# Altium schematic sheet CAN-FD.SchDoc
size 420 x 297 mm; SheetNumber: 28; SheetTotal: 42; DocumentTypeShort: Э3; DocumentInvertoryNumber: ㅤ
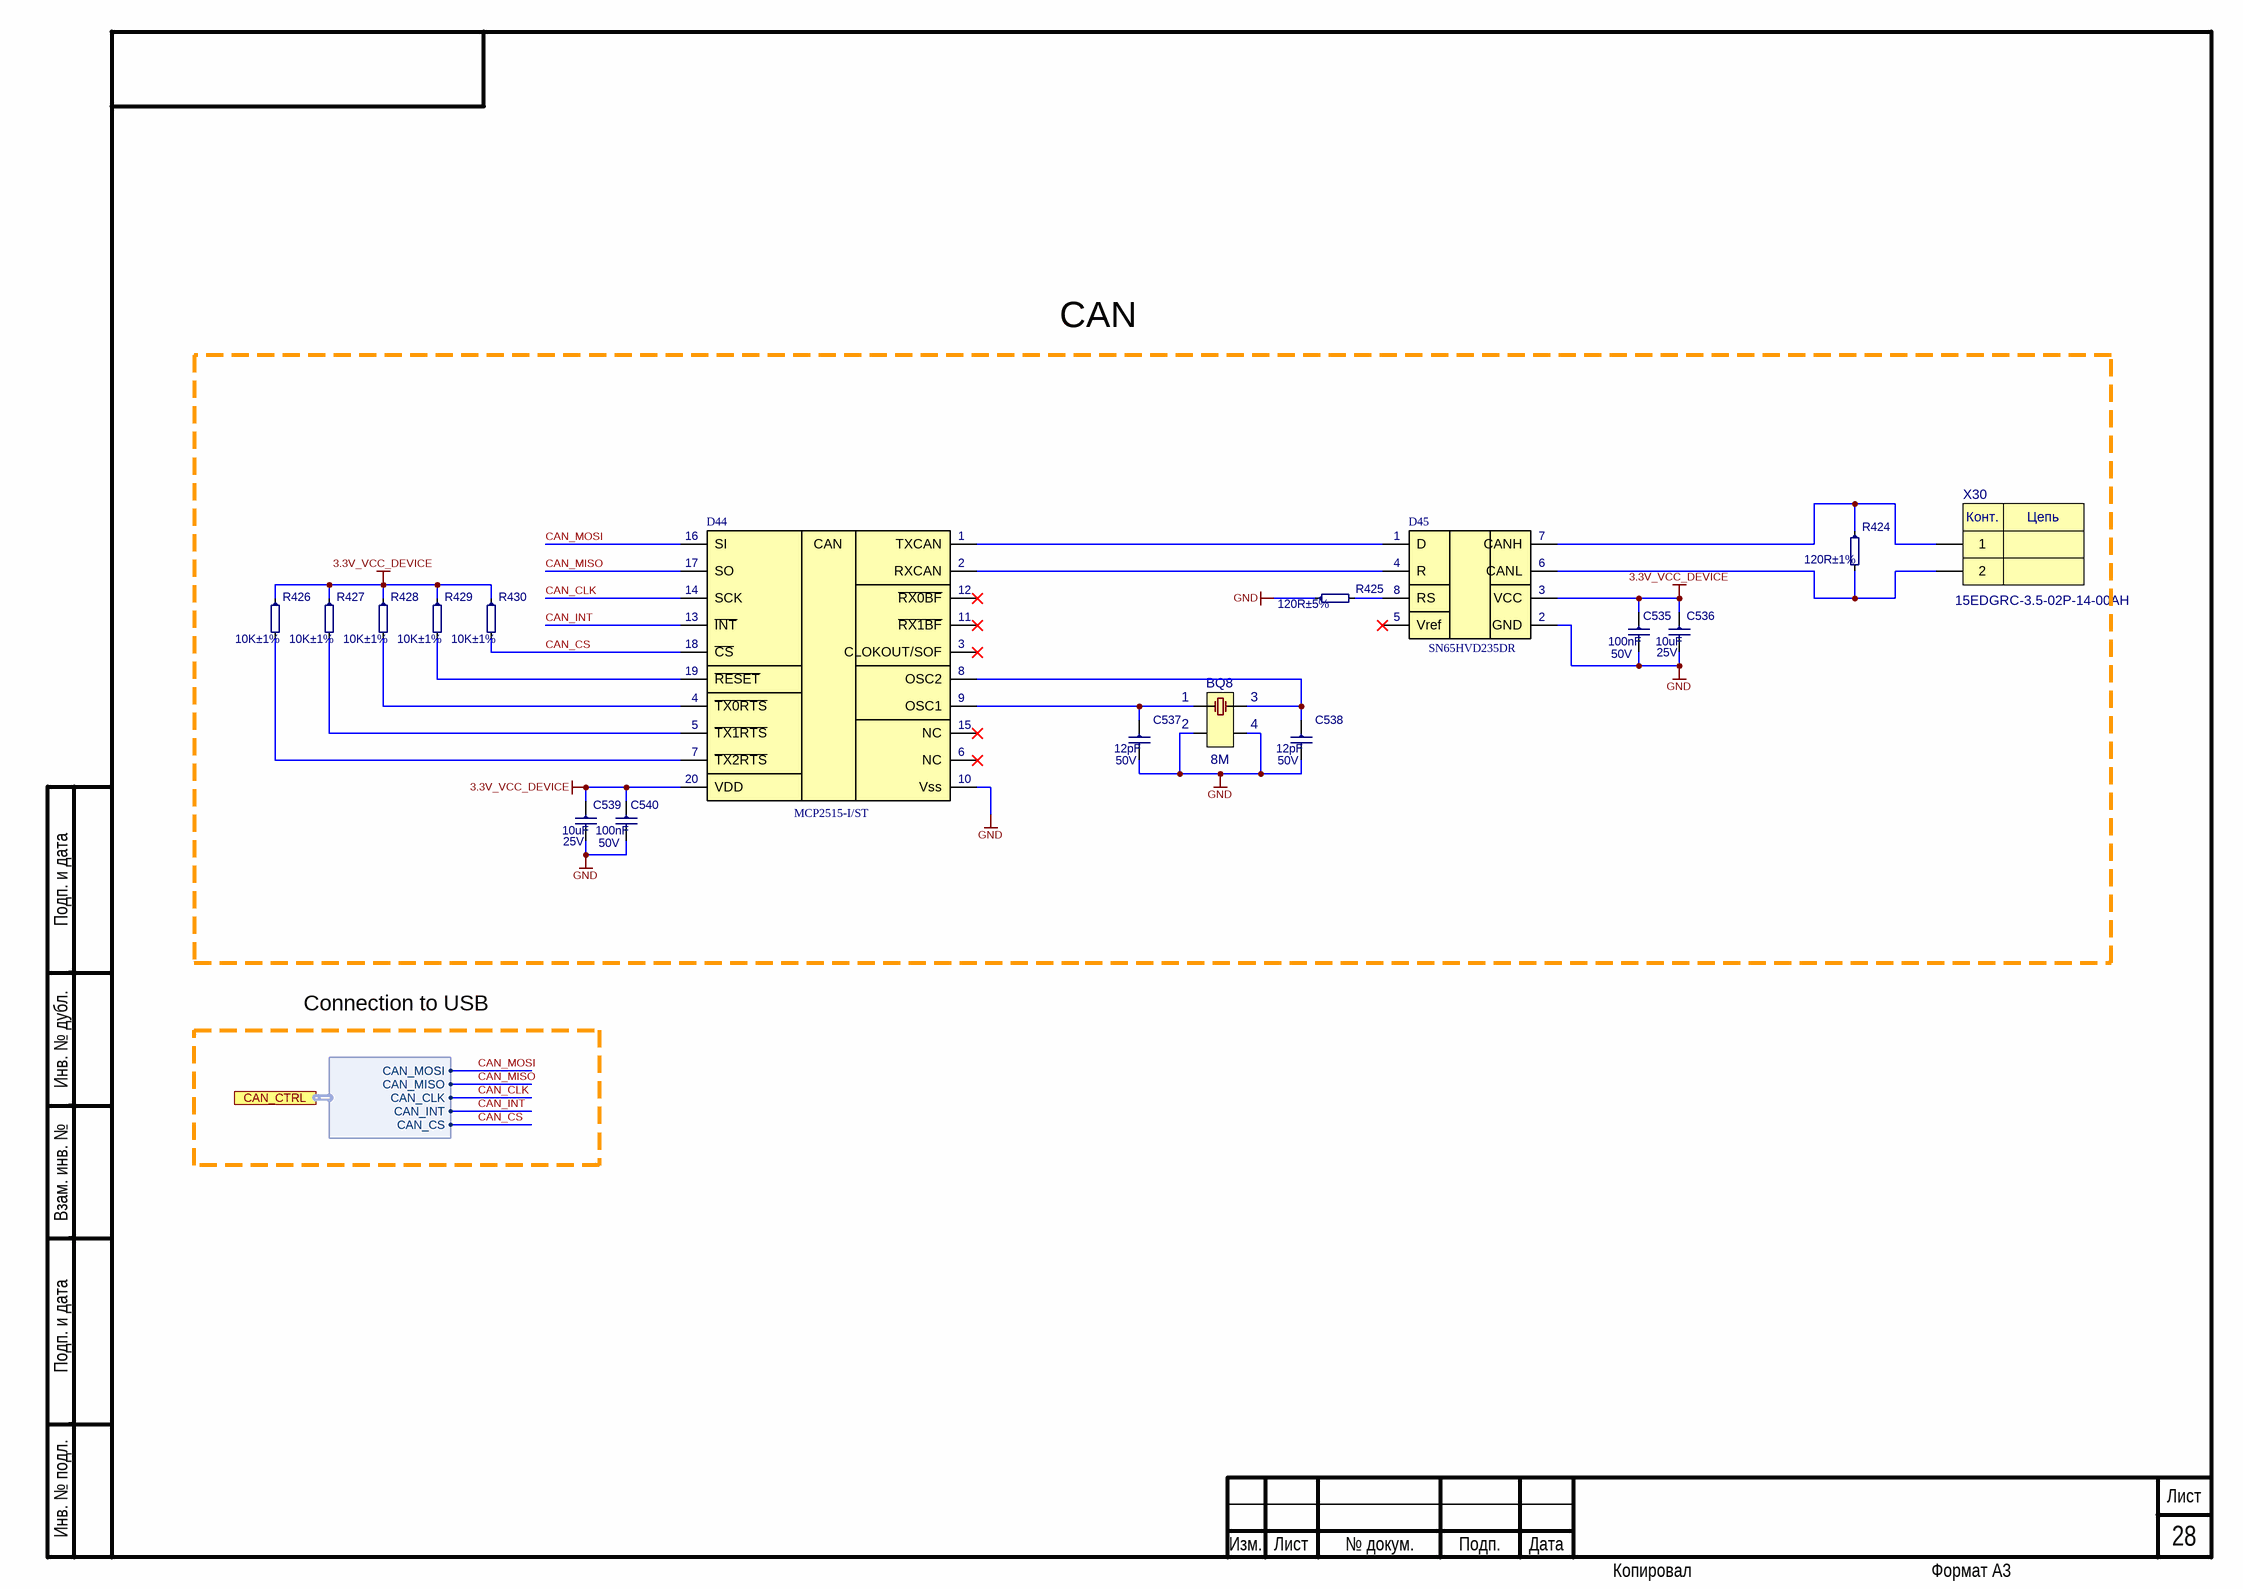
[diagram p0: CAN-FD.SchDoc]

## Parts
BQ8  8M  [NX3225GA]
C535  100nF  Voltage: 50V  [C0402]
C536  10uF  Voltage: 25V  [C0805]
C537  12pF  Voltage: 50V  [C0402]
C538  12pF  Voltage: 50V  [C0402]
C539  10uF  Voltage: 25V  [C0805]
C540  100nF  Voltage: 50V  [C0402]
D44  MCP2515-I/ST  [MCP2515-I/ST]
D45  SN65HVD235DR  [SN65HVD235DR]
R424  120R±1%  [R1206]
R425  120R±5%  [R0402]
R426  10K±1%  [R0402]
R427  10K±1%  [R0402]
R428  10K±1%  [R0402]
R429  10K±1%  [R0402]
R430  10K±1%  [R0402]
X30  15EDGRC-3.5-02P-14-00AH  [D1RFRD006-02]

## Ports
CAN_CTRL (harness CAN_CTRL)

## Harnesses
CAN_CTRL: CAN_MISO, CAN_MOSI, CAN_CLK, CAN_INT, CAN_CS

## Nets
3.3V_VCC_DEVICE: C535.1 C536.1 C539.1 C540.1 D44.20(VDD) D45.3(VCC) R426.1 R427.1 R428.1 R429.1 R430.1
GND: BQ8.2 BQ8.4 C535.2 C536.2 C537.2 C538.2 C539.2 C540.2 D44.10(Vss) D45.2(GND) R425.1
CAN_CLK: D44.14(SCK) ; port CAN_CTRL.CAN_CLK
CAN_CS: D44.18(~{CS}) R430.2 ; port CAN_CTRL.CAN_CS
CAN_INT: D44.13(~{INT}) ; port CAN_CTRL.CAN_INT
CAN_MISO: D44.17(SO) ; port CAN_CTRL.CAN_MISO
CAN_MOSI: D44.16(SI) ; port CAN_CTRL.CAN_MOSI
NetBQ8_1: BQ8.1 C537.1 D44.9(OSC1)
NetBQ8_3: BQ8.3 C538.1 D44.8(OSC2)
NetD44_1: D44.1(TXCAN) D45.1(D)
NetD44_2: D44.2(RXCAN) D45.4(R)
NetD44_4: D44.4(~{TX0RTS}) R428.2
NetD44_5: D44.5(~{TX1RTS}) R427.2
NetD44_7: D44.7(~{TX2RTS}) R426.2
NetD44_19: D44.19(~{RESET}) R429.2
NetD45_6: D45.6(CANL) R424.2 X30.2
NetD45_7: D45.7(CANH) R424.1 X30.1
NetD45_8: D45.8(RS) R425.2

Not connected (* = marked no-connect by the designer): D44 3(CLOKOUT/SOF)* 6(NC)* 11(~{RX1BF})* 12(~{RX0BF})* 15(NC)*; D45 5(Vref)*

## Notes on the sheet
- CAN
- Connection to USB
- Подп. и дата
- Инв. № дубл.
- Взам. инв. №
- Инв. № подл.
- Изм.
- Лист
- № докум.
- Подп.
- Дата
- Копировал
- Формат А3
- (in symbol 15EDGRC-3.5-02P-14-00AH) Конт.; Цепь
- (in symbol MCP2515-I/ST) CAN

## Library data of the parts
BQ8 = DSX321G 8 MHZ: 8MHz 3225 quartz 4 pin; Part Number: X32258MOB4SI; Manufacturer: YXC Crystal Oscillators; Place: *); Tolerance: 20ppm; Check: False; Value: 8M; Temperature: -40°C~85°C; NameFromManufacturer: X32258MOB4SI; ComponentLink1Description: DATASHEET; ComponentLink1URL: https://www.promelec.ru/fs/sources/95/f4/1b/b5/0db2e911831872b0ebc49c9b.pdf; Last changed: 24.01.2024; Analog: X32258MOB4SI
C535 C540 = 0402-X7R-50V-0.1uF±10%: Ceramic Capacitor 0402 100nF ±10% 50V X7R; Manufacturer: Yageo; NameFromManufacturer: CC0402KRX7R9BB104; Place: *); Check: False; Dielectric: X7R; Case: C0402; Part Number: 0402-X7R-50V-0.1uF±10%; Value: 100nF; Tolerance: 10%; Temperature: -55°C~125°C; ComponentLink2Description: Link to datasheet; ComponentLink1Description: DATASHEET; ComponentLink2URL: https://www.lcsc.com/product-detail/Multilayer-Ceramic-Capacitors-MLCC-SMD-SMT_YAGEO-CC0402KRX7R9BB104_C131394.html; Last changed: 09.04.2025
C536 C539 = 0805-X5R-25V-10uF±10%: Manufacturer: Samsung; NameFromManufacturer: CL21A106KAYNNNE; Dielectric: X5R; Place: *); Tolerance: 10%; Check: False; Case: C0805; Part Number: 0805-X5R-25V-10uF±10%; Value: 10uF; Temperature: -55°C~85°C; ComponentLink2Description: Link to datasheet; ComponentLink1Description: DATASHEET; ComponentLink2URL: https://www.terraelectronica.ru/product/1640984; ComponentLink1URL: Datasheets/capacitors/MLCC-1837944.pdf; Last changed: 27.10.2022
C537 C538 = 0402-NP0-50V-12pF±5%: Manufacturer: Murata Electronics; NameFromManufacturer: GRM1555C1H120JA01D; Dielectric: NP0; Place: *); Tolerance: 5%; Check: False; Case: C0402; Part Number: 0402-NP0-50V-12pF±5%; Value: 12pF; Temperature: -55°C~125°C; ComponentLink2Description: Link to datasheet; ComponentLink1Description: DATASHEET; ComponentLink2URL: https://www.terraelectronica.ru/pdf/show?pdf_file=http%253A%252F%252Fwww.farnell.com%252Fdatasheets%252F2048662.pdf; ComponentLink1URL: Datasheets/capacitors/GRM1555C1H120JA01-01A.pdf; Last changed: 27.10.2022
D44 = MCP2515-I/ST: 1Mbps CAN Controller TSSOP-20 Interface Controllers RoHS; Manufacturer: MICROCHIP; Check: False; Part Number: MCP2515-I/ST; NameFromManufacturer: MCP2515-I/ST; Value: MCP2515-I/ST
D45 = SN65HVD235DR: 3V~3.6V CAN Transceiver 1Mbps SOIC-8 Drivers, Receivers, Transceivers RoHS; Manufacturer: TI; Check: False; Part Number: SN65HVD235DR; NameFromManufacturer: SN65HVD235DR; Value: SN65HVD235DR
R424 = 1206-0.25W-120R-100ppm±1%: NameFromManufacturer: RC1206FR-07120RL; Manufacturer: Yageo; Place: *); Value: 120R; Tolerance: 1%; Check: False; Case: R1206; Part Number: 1206-0.25W-120R-100ppm±1%; Temperature: -55°C~155°C; ComponentLink1Description: DATASHEET; ComponentLink1URL: https://www.yageo.com/upload/media/product/productsearch/datasheet/rchip/PYu-RC_Group_51_RoHS_L_11.pdf; Datasheet: Datasheets/resistors/PYu-RC_Group_51_RoHS_L_11.pdf; Last changed: 27.10.2022
R425 = 0402-0.0625W-120R-200ppm±5%: NameFromManufacturer: RC0402JR-07120RL; Manufacturer: Yageo; Place: *); Value: 120R; Tolerance: 5%; Check: False; Case: R0402; Part Number: 0402-0.0625W-120R-200ppm±5%; Temperature: -55°C~155°C; ComponentLink1Description: DATASHEET; ComponentLink1URL: https://www.electronshik.ru/item/YAG/RC0402JR-07120RL; Datasheet: Datasheets/resistors/PYu-RC_Group_51_RoHS_L_12.pdf; Last changed: 27.10.2022
R426-R430 = 0402-0.0625W-10K-100ppm±1%: Chip Resistor 0402 10kΩ ±1% 50V ±100ppm/℃ Thick Film; NameFromManufacturer: RC0402FR-0710KL; Manufacturer: Yageo; Place: *); Value: 10K; Check: False; Case: R0402; Part Number: 0402-0.0625W-10K-100ppm±1%; Tolerance: 1%; Temperature: -55°C~155°C; ComponentLink1Description: DATASHEET; ComponentLink1URL: https://ru.mouser.com/ProductDetail/YAGEO/RC0402FR-0710KL?qs=%2Fha2pyFaduhjtLcYvKXQ8IogF7YwN7YtH%252BOO8ZtEEMnoa4yoWYcwpw%3D%3D; Datasheet: Datasheets/resistors/PYu-RC_Group_51_RoHS_L_11.pdf; Last changed: 27.10.2022
X30 = 15EDGRC-3.5-02P-14-00AH: Terminal block 2; Manufacturer: Degson; Place: *); Check: False; Part Number: 15EDGRC-3.5-02P-14-00AH; Value: 15EDGRC-3.5-02P-14-00AH; Temperature: -40°C~105°C; ComponentLink1Description: DATASHEET; NameFromManufacturer: 15EDGRC-3.5-02P-14-00AH; ComponentLink1URL: https://octopart.com/15edgrc-3.5-02p-14-00ah-degson-71132713?r=sp; Datasheet: Datasheets/connectors/DOC000872098.pdf; Last changed: 27.10.2022